# EAGLE schematic test (EAGLE 9.5.2)
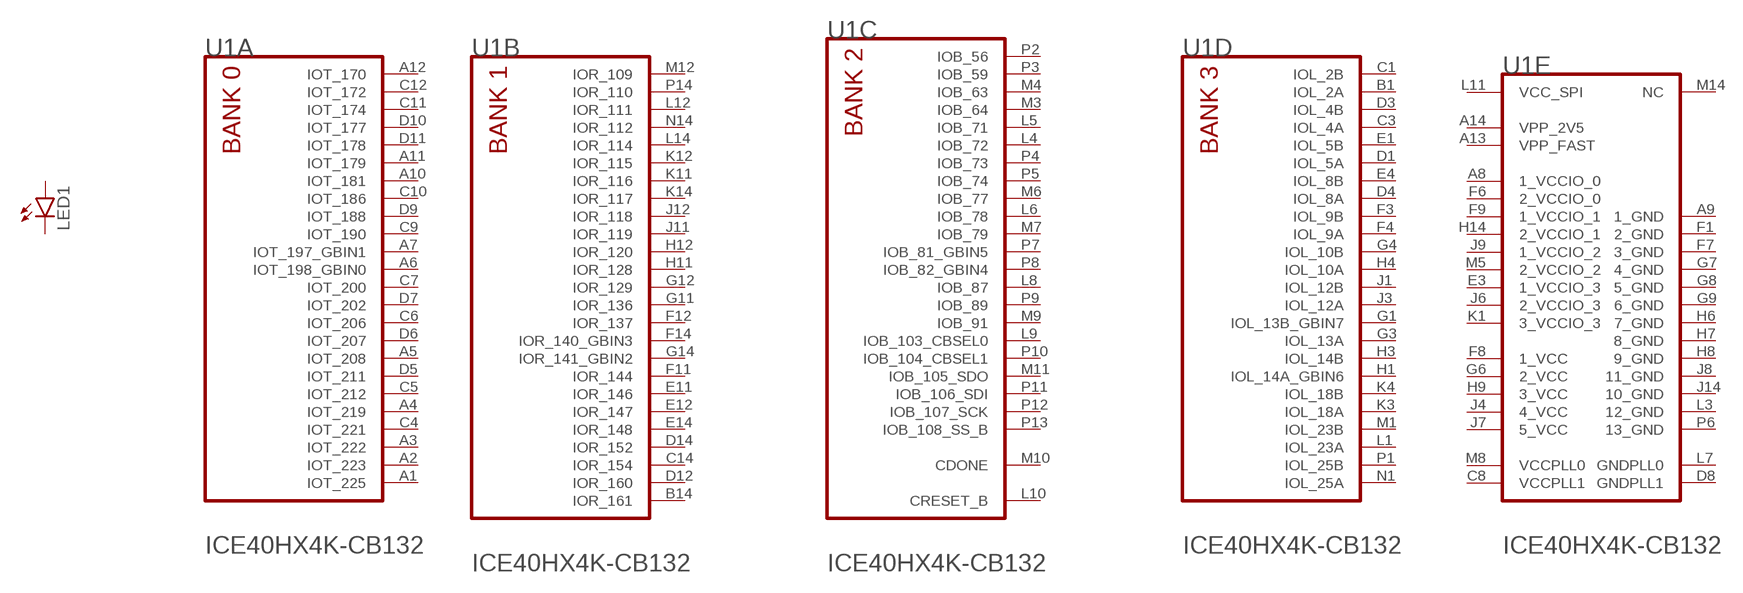
[diagram p0: schematic, sheet 1]

## Parts
LED1  LED_LEDCHIPLED_0603  [LED_CHIPLED_0603]
U1  LATTICE-SEMICONDUCTOR---ICE40HX4K-CB132_LATTICE_SEMICONDUCTOR_ICE40HX4K-CB132LATTICE_SEMICONDUCTOR_ICE40HX4K-CB132_0_0  [LATTICE-SEMICONDUCTOR---ICE40HX4K-CB132_LATTICE_SEMICONDUCTOR_ICE40HX4K-CB132_0]
Unconnected: LED1.A LED1.C U1.A1(A:IOT_225) U1.A2(A:IOT_223) U1.A3(A:IOT_222) U1.A4(A:IOT_219) U1.A5(A:IOT_208) U1.A6(A:IOT_198_GBIN0) U1.A7(A:IOT_197_GBIN1) U1.A10(A:IOT_181) U1.A11(A:IOT_179) U1.A12(A:IOT_170) U1.B1(D:IOL_2A) U1.B14(B:IOR_161) U1.C1(D:IOL_2B) U1.C3(D:IOL_4A) U1.C4(A:IOT_221) U1.C5(A:IOT_212) U1.C6(A:IOT_206) U1.C7(A:IOT_200) U1.C9(A:IOT_190) U1.C10(A:IOT_186) U1.C11(A:IOT_174) U1.C12(A:IOT_172) U1.C14(B:IOR_154) U1.D1(D:IOL_5A) U1.D3(D:IOL_4B) U1.D4(D:IOL_8A) U1.D5(A:IOT_211) U1.D6(A:IOT_207) U1.D7(A:IOT_202) U1.D9(A:IOT_188) U1.D10(A:IOT_177) U1.D11(A:IOT_178) U1.D12(B:IOR_160) U1.D14(B:IOR_152) U1.E1(D:IOL_5B) U1.E4(D:IOL_8B) U1.E11(B:IOR_146) U1.E12(B:IOR_147) U1.E14(B:IOR_148) U1.F3(D:IOL_9B) U1.F4(D:IOL_9A) U1.F11(B:IOR_144) U1.F12(B:IOR_137) U1.F14(B:IOR_140_GBIN3) U1.G1(D:IOL_13B_GBIN7) U1.G3(D:IOL_13A) U1.G4(D:IOL_10B) U1.G11(B:IOR_136) U1.G12(B:IOR_129) U1.G14(B:IOR_141_GBIN2) U1.H1(D:IOL_14A_GBIN6) U1.H3(D:IOL_14B) U1.H4(D:IOL_10A) U1.H11(B:IOR_128) U1.H12(B:IOR_120) U1.J1(D:IOL_12B) U1.J3(D:IOL_12A) U1.J11(B:IOR_119) U1.J12(B:IOR_118) U1.K3(D:IOL_18A) U1.K4(D:IOL_18B) U1.K11(B:IOR_116) U1.K12(B:IOR_115) U1.K14(B:IOR_117) U1.L1(D:IOL_23A) U1.L4(C:IOB_72) U1.L5(C:IOB_71) U1.L6(C:IOB_78) U1.L8(C:IOB_87) U1.L9(C:IOB_103_CBSEL0) U1.L10(C:CRESET_B) U1.L12(B:IOR_111) U1.L14(B:IOR_114) U1.M1(D:IOL_23B) U1.M3(C:IOB_64) U1.M4(C:IOB_63) U1.M6(C:IOB_77) U1.M7(C:IOB_79) U1.M9(C:IOB_91) U1.M10(C:CDONE) U1.M11(C:IOB_105_SDO) U1.M12(B:IOR_109) U1.M14(E:NC) U1.N1(D:IOL_25A) U1.N14(B:IOR_112) U1.P1(D:IOL_25B) U1.P2(C:IOB_56) U1.P3(C:IOB_59) U1.P4(C:IOB_73) U1.P5(C:IOB_74) U1.P7(C:IOB_81_GBIN5) U1.P8(C:IOB_82_GBIN4) U1.P9(C:IOB_89) U1.P10(C:IOB_104_CBSEL1) U1.P11(C:IOB_106_SDI) U1.P12(C:IOB_107_SCK) U1.P13(C:IOB_108_SS_B) U1.P14(B:IOR_110)

## Power pins joined to a net without a drawn wire
1_GND: U1.A9(E:1_GND)
1_VCC: U1.F8(E:1_VCC)
1_VCCIO_0: U1.A8(E:1_VCCIO_0)
1_VCCIO_1: U1.F9(E:1_VCCIO_1)
1_VCCIO_2: U1.J9(E:1_VCCIO_2)
1_VCCIO_3: U1.E3(E:1_VCCIO_3)
2_GND: U1.F1(E:2_GND)
2_VCC: U1.G6(E:2_VCC)
2_VCCIO_0: U1.F6(E:2_VCCIO_0)
2_VCCIO_1: U1.H14(E:2_VCCIO_1)
2_VCCIO_2: U1.M5(E:2_VCCIO_2)
2_VCCIO_3: U1.J6(E:2_VCCIO_3)
3_GND: U1.F7(E:3_GND)
3_VCC: U1.H9(E:3_VCC)
3_VCCIO_3: U1.K1(E:3_VCCIO_3)
4_GND: U1.G7(E:4_GND)
4_VCC: U1.J4(E:4_VCC)
5_GND: U1.G8(E:5_GND)
5_VCC: U1.J7(E:5_VCC)
6_GND: U1.G9(E:6_GND)
7_GND: U1.H6(E:7_GND)
8_GND: U1.H7(E:8_GND)
9_GND: U1.H8(E:9_GND)
10_GND: U1.J14(E:10_GND)
11_GND: U1.J8(E:11_GND)
12_GND: U1.L3(E:12_GND)
13_GND: U1.P6(E:13_GND)
GNDPLL0: U1.L7(E:GNDPLL0)
GNDPLL1: U1.D8(E:GNDPLL1)
VCC_SPI: U1.L11(E:VCC_SPI)
VCCPLL0: U1.M8(E:VCCPLL0)
VCCPLL1: U1.C8(E:VCCPLL1)
VPP_2V5: U1.A14(E:VPP_2V5)
VPP_FAST: U1.A13(E:VPP_FAST)

## Library data of the parts
LED1 = MotionDetectorCamera:LED_LED: LED OSRAM: - CHIPLED LG R971, LG N971, LY N971, LG Q971, LY Q971, LO R971, LY R971 LH N974, LH R974 LS Q976, LO Q976, LY Q976 LO Q996 - Hyper CHIPLED LW Q18S LB Q993, LB Q99A, LB R99A - SideLED LS A670, LO A670, LY A670, LG A670, LP A670 LB A673, LV A673, LT A673, LW A673 LH A674 LY A675 LS A676, LA A676, LO A676, LY A676, LW A676 LS A679, LY A679, LG A679 - Hyper Micro SIDELED® LS Y876, LA Y876, LO Y876, LY Y876 LT Y87S - SmartLED LW L88C, LW L88S LB L89C, LB L89S, LG L890 LS L89K, LO L89K, LY L89K LS L896, LA L896, LO L896, LY L896 - TOPLED LS T670, LO T670, LY T670, LG T670, LP T670 LSG T670, LSP T670, LSY T670, LOP T670, LYG T670 LG T671, LOG T671, LSG T671 LB T673, LV T673, LT T673, LW T673 LH T674 LS T676, LA T676, LO T676, LY T676, LB T676, LH T676, LSB T676, LW T676 LB T67C, LV T67C, LT T67C, LS T67K, LO T67K, LY T67K, LW E67C LS E67B, LA E67B, LO E67B, LY E67B, LB E67C, LV E67C, LT E67C LW T67C LS T679, LY T679, LG T679 LS T770, LO T770, LY T770, LG T770, LP T770 LB T773, LV T773, LT T773, LW T773 LH T774 LS E675, LA E675, LY E675, LS T675 LS T776, LA T776, LO T776, LY T776, LB T776 LHGB T686 LT T68C, LB T68C - Hyper Mini TOPLED® LB M676 - Mini TOPLED Santana® LG M470 LS M47K, LO M47K, LY M47K Source: http://www.osram.convergy.de LUXEON: - LUMILED® LXK2-PW12-R00, LXK2-PW12-S00, LXK2-PW14-U00, LXK2-PW14-V00 LXK2-PM12-R00, LXK2-PM12-S00, LXK2-PM14-U00 LXK2-PE12-Q00, LXK2-PE12-R00, LXK2-PE12-S00, LXK2-PE14-T00, LXK2-PE14-U00 LXK2-PB12-K00, LXK2-PB12-L00, LXK2-PB12-M00, LXK2-PB14-N00, LXK2-PB14-P00, LXK2-PB14-Q00 LXK2-PR12-L00, LXK2-PR12-M00, LXK2-PR14-Q00, LXK2-PR14-R00 LXK2-PD12-Q00, LXK2-PD12-R00, LXK2-PD12-S00 LXK2-PH12-R00, LXK2-PH12-S00 LXK2-PL12-P00, LXK2-PL12-Q00, LXK2-PL12-R00 Source: www.luxeon.com KINGBRIGHT: KA-3528ASYC Source: www.kingbright.com
U1 = MotionDetectorCamera:LATTICE-SEMICONDUCTOR---ICE40HX4K-CB132_LATTICE_SEMICONDUCTOR_ICE40HX4K-CB132: LATC-HXxK-csBGA-132; CIIVA_IDS: 1134083; COMPONENT_LINK_1_DESCRIPTION: Manufacturer URL; COMPONENT_LINK_1_URL: http://www.latticesemi.com/en; COMPONENT_LINK_3_DESCRIPTION: Package Specification; COMPONENT_LINK_3_URL: http://www.latticesemi.com/lit/docs/package/pkg.pdf; DATASHEET: http://www.latticesemi.com/~/media/Documents/DataSheets/iCE/iCE40LPHXFamilyDataSheet.pdf; DATASHEET_VERSION: Rev. 02.9; EMBEDDED_RAM_BITS: 80K; FOOTPRINT_VARIANT_NAME_0: Manufacturer Recommended; IMPORTED: yes; IMPORTED_FROM: vault; IMPORT_TS: 1521859977; LOGIC_CELLS: 3520; MF: Lattice Semiconductor; MOUNTING_TECHNOLOGY: Surface Mount; MPN: ICE40HX4K-CB132; PACKAGE: csBGA-132; PACKAGE_DESCRIPTION: 132-Ball Chip Scale Ball Grid Array, Body 8 x 8 mm, Pitch 0.5 mm; PACKAGE_VERSION: Rev. 03.9, 02/2013; PACKING: Tray; PHASE_LOCKED_LOOPS: 2; PIN_0_0_10_INSIDE_EDGE: clock; PIN_0_0_11_INSIDE_EDGE: clock; PIN_0_1_15_INSIDE_EDGE: clock; PIN_0_1_16_INSIDE_EDGE: clock; PIN_0_2_13_INSIDE_EDGE: clock; PIN_0_2_14_INSIDE_EDGE: clock; PIN_0_2_22_INSIDE_EDGE: clock; PIN_0_3_15_INSIDE_EDGE: clock; PIN_0_3_16_INSIDE_EDGE: clock; PREFIX: U; RELEASE_DATE: 1399310374; ROHS: Yes; SUPPLY_VOLTAGE: 1.2V; VAULT_GUID: 9F6F6CC5-81E1-4925-A6A6-21FD61614BFD; VAULT_REVISION: 395FDF84-D05A-471C-BF0F-E44D2953D20B